# EAGLE design Lumiboard-SMD-DX-v003-stew (EAGLE 6.3)
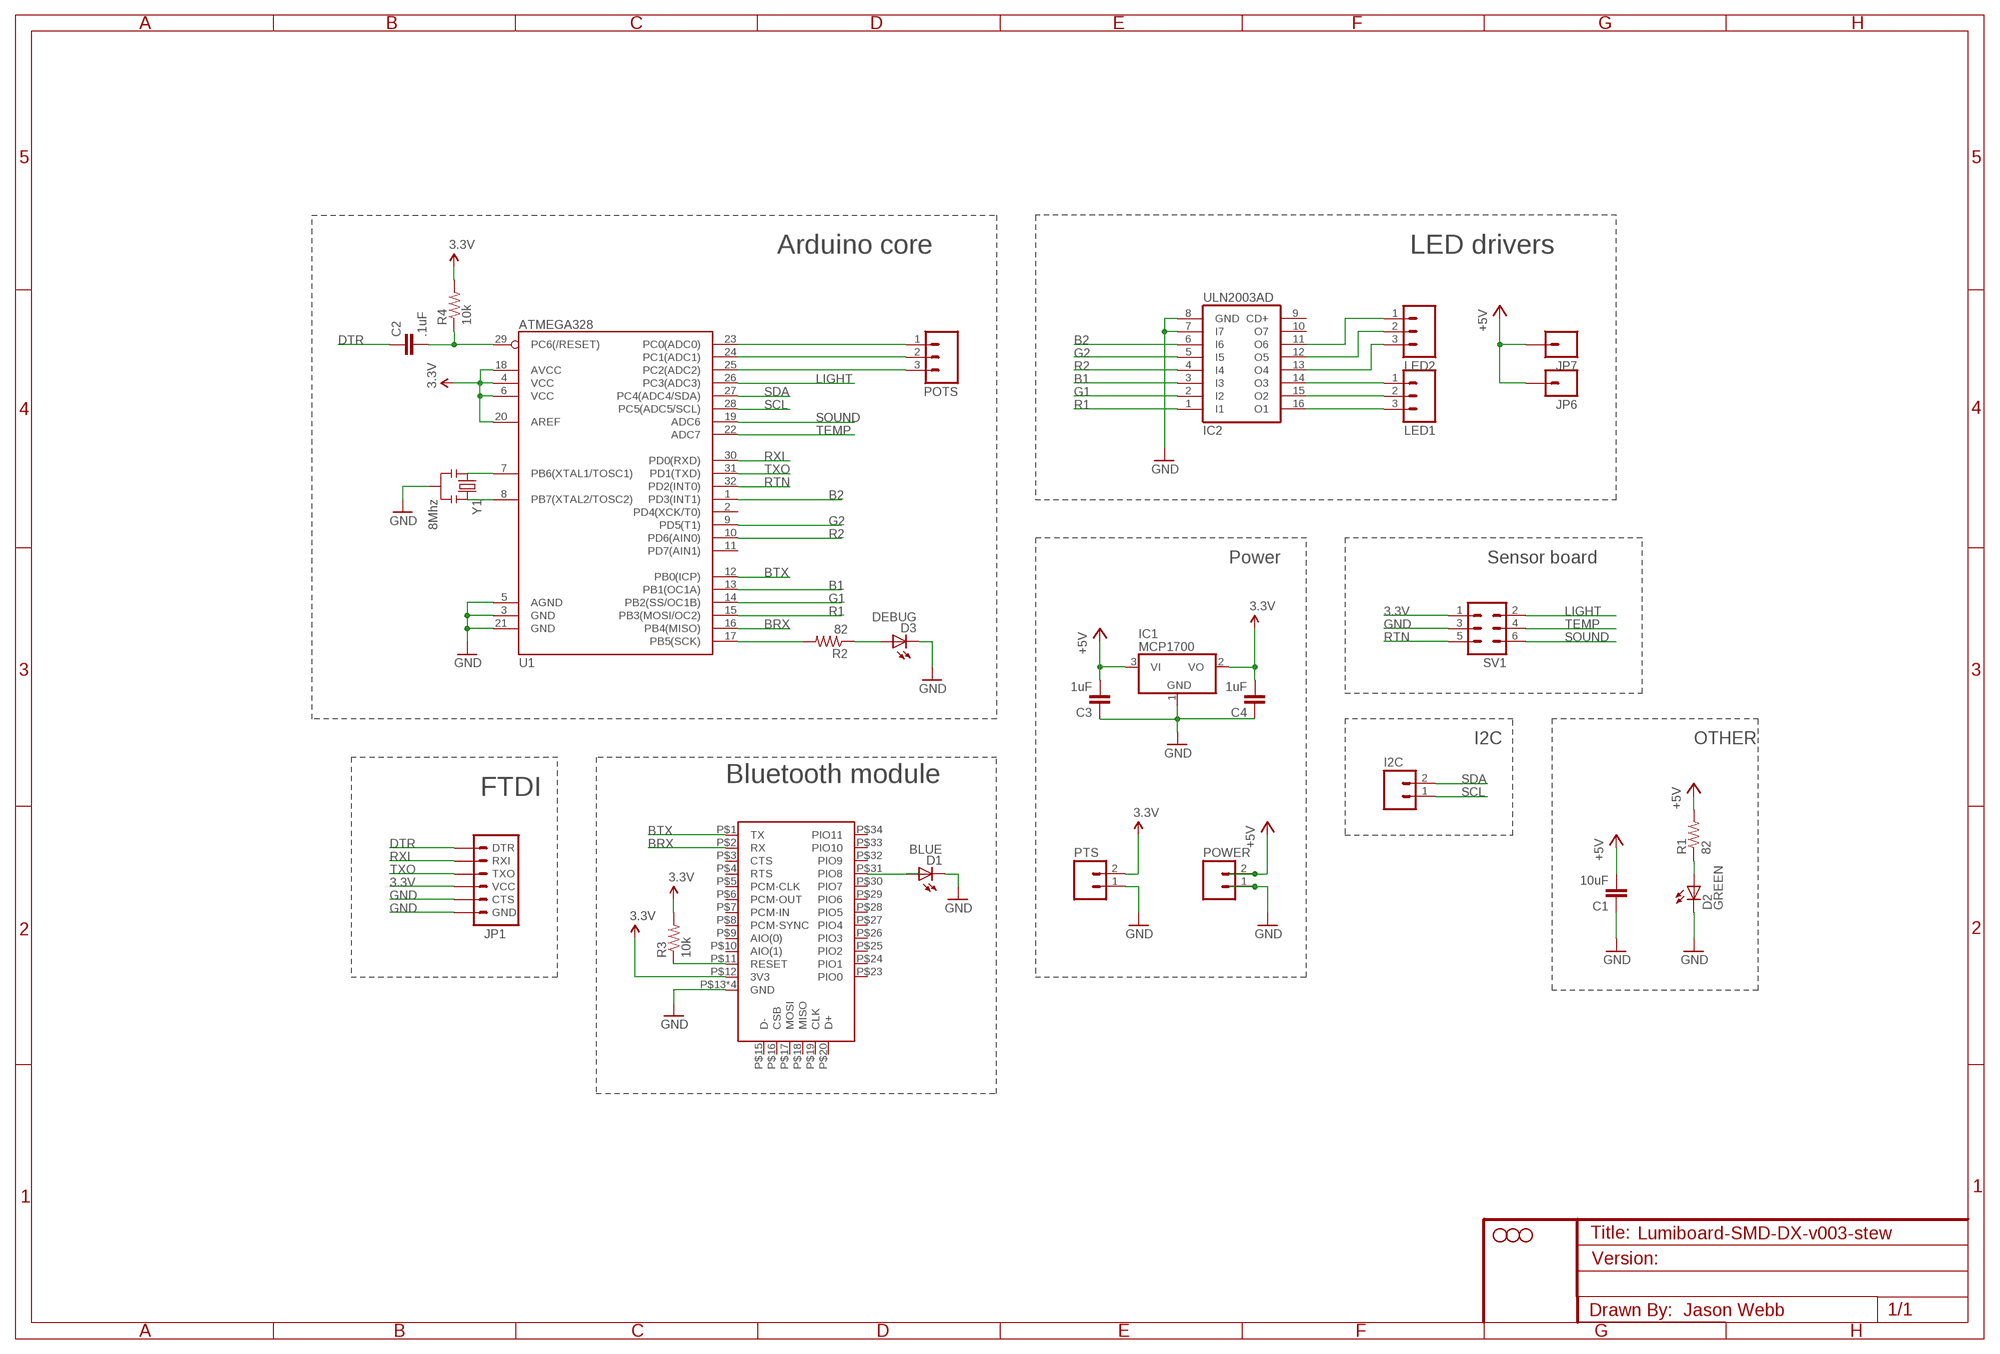
[diagram p0: schematic, sheet 1]

## Parts
C1  10uF  CAP0805  [0805]
C2  .1uF  CAP0805  [0805]
C3  1uF  CAP0805  [0805]
C4  1uF  CAP0805  [0805]
D1  BLUE  LEDCHIPLED_0805  [CHIPLED_0805]
D2  GREEN  LEDCHIPLED_0805  [CHIPLED_0805]
D3  DEBUG  LEDCHIPLED_0805  [CHIPLED_0805]
I2C  M02PTH  [1X02]
IC1  MCP1700  MCP1703CB  [SOT23]
IC2  ULN2003AD  [SO16]
JP1  ARDUINO_SERIAL_PROGRAMLOCK  [1X06_LOCK]
JP2  STAND-OFFTIGHT  [STAND-OFF-TIGHT]
JP4  STAND-OFFTIGHT  [STAND-OFF-TIGHT]
JP5  STAND-OFFTIGHT  [STAND-OFF-TIGHT]
JP6  M01PTH  [1X01]
JP7  M01PTH  [1X01]
LED1  M03PTH  [1X03]
LED2  M03PTH  [1X03]
POTS  M03PTH  [1X03]
POWER  M02PTH  [1X02]
PTS  M02PTH  [1X02]
R1  82  R-US_R0805  [R0805]
R2  82  R-US_R0805  [R0805]
R3  10k  R-US_R0805  [R0805]
R4  10k  R-US_R0805  [R0805]
SV1  ML6  [ML6]
U1  ATMEGA328  ATMEGA168  [TQFP32-08]
U2  DX_BT_MODULE  [DXBLUETOOTHMODULE]
Y1  8Mhz  RESONATORSMD  [RESONATOR-SMD]

## Nets
3.3V: C4.2 IC1.2(VO) JP1.4(VCC) PTS.2 R3.2 R4.2 SV1.1 U1.4(VCC) U1.6(VCC) U1.18(AVCC) U1.20(AREF) U2.P$12(3V3)
+5V: C1.2 C3.2 IC1.3(VI) JP6.1 JP7.1 POWER.2 R1.2
B1: IC2.3(I3) U1.13(PB1(OC1A))
B2: IC2.6(I6) U1.1(PD3(INT1))
BRX: U1.16(PB4(MISO)) U2.P$2(RX)
BTX: U1.12(PB0(ICP)) U2.P$1(TX)
DTR: C2.1 JP1.1(DTR)
G1: IC2.2(I2) U1.14(PB2(SS/OC1B))
G2: IC2.5(I5) U1.9(PD5(T1))
GND: C1.1 C3.1 C4.1 D1.C D2.C D3.C IC1.1(GND) IC2.7(I7) IC2.8(GND) JP1.5(CTS) JP1.6(GND) POWER.1 PTS.1 SV1.3 U1.3(GND) U1.5(AGND) U1.21(GND) U2.P$13(GND) U2.P$14(GND) U2.P$21(GND) U2.P$22(GND) Y1.2
LIGHT: SV1.2 U1.26(PC3(ADC3))
N$1: IC2.11(O6) LED2.1
N$2: D1.A U2.P$31(PIO8)
N$3: IC2.12(O5) LED2.2
N$4: R2.2 U1.17(PB5(SCK))
N$5: IC2.13(O4) LED2.3
N$7: U1.7(PB6(XTAL1/TOSC1)) Y1.1
N$8: U1.8(PB7(XTAL2/TOSC2)) Y1.3
N$9: D2.A R1.1
N$10: C2.2 R4.1 U1.29(PC6(/RESET))
N$11: R3.1 U2.P$11(RESET)
N$12: POTS.3 U1.25(PC2(ADC2))
N$13: D3.A R2.1
N$17: IC2.14(O3) LED1.1
N$18: IC2.15(O2) LED1.2
N$19: IC2.16(O1) LED1.3
N$20: POTS.2 U1.24(PC1(ADC1))
N$22: POTS.1 U1.23(PC0(ADC0))
R1: IC2.1(I1) U1.15(PB3(MOSI/OC2))
R2: IC2.4(I4) U1.10(PD6(AIN0))
RTN: SV1.5 U1.32(PD2(INT0))
RXI: JP1.2(RXI) U1.30(PD0(RXD))
SCL: I2C.1 U1.28(PC5(ADC5/SCL))
SDA: I2C.2 U1.27(PC4(ADC4/SDA))
SOUND: SV1.6 U1.19(ADC6)
TEMP: SV1.4 U1.22(ADC7)
TXO: JP1.3(TXO) U1.31(PD1(TXD))
Unconnected: IC2.9(CD+) IC2.10(O7) U1.2(PD4(XCK/T0)) U1.11(PD7(AIN1)) U2.P$3(CTS) U2.P$4(RTS) U2.P$5(PCM-CLK) U2.P$6(PCM-OUT) U2.P$7(PCM-IN) U2.P$8(PCM-SYNC) U2.P$9(AIO(0)) U2.P$10(AIO(1)) U2.P$15(D-) U2.P$16(CSB) U2.P$17(MOSI) U2.P$18(MISO) U2.P$19(CLK) U2.P$20(D+) U2.P$23(PIO0) U2.P$24(PIO1) U2.P$25(PIO2) U2.P$26(PIO3) U2.P$27(PIO4) U2.P$28(PIO5) U2.P$29(PIO6) U2.P$30(PIO7) U2.P$32(PIO9) U2.P$33(PIO10) U2.P$34(PIO11)

## Notes on the sheet
- Arduino core | LED drivers
- Power | Sensor board
- I2C | OTHER
- Bluetooth module
- FTDI
- Jason Webb

## Library data of the parts
C1-C4 = SparkFun:CAP: Capacitor Standard 0603 ceramic capacitor, and 0.1" leaded capacitor.
D1-D3 = led:LED: LED OSRAM: - CHIPLED LG R971, LG N971, LY N971, LG Q971, LY Q971, LO R971, LY R971 LH N974, LH R974 LS Q976, LO Q976, LY Q976 LO Q996 - Hyper CHIPLED LW Q18S LB Q993, LB Q99A, LB R99A - SideLED LS A670, LO A670, LY A670, LG A670, LP A670 LB A673, LV A673, LT A673, LW A673 LH A674 LY A675 LS A676, LA A676, LO A676, LY A676, LW A676 LS A679, LY A679, LG A679 - Hyper Micro SIDELED® LS Y876, LA Y876, LO Y876, LY Y876 LT Y87S - SmartLED LW L88C, LW L88S LB L89C, LB L89S, LG L890 LS L89K, LO L89K, LY L89K LS L896, LA L896, LO L896, LY L896 - TOPLED LS T670, LO T670, LY T670, LG T670, LP T670 LSG T670, LSP T670, LSY T670, LOP T670, LYG T670 LG T671, LOG T671, LSG T671 LB T673, LV T673, LT T673, LW T673 LH T674 LS T676, LA T676, LO T676, LY T676, LB T676, LH T676, LSB T676, LW T676 LB T67C, LV T67C, LT T67C, LS T67K, LO T67K, LY T67K, LW E67C LS E67B, LA E67B, LO E67B, LY E67B, LB E67C, LV E67C, LT E67C LW T67C LS T679, LY T679, LG T679 LS T770, LO T770, LY T770, LG T770, LP T770 LB T773, LV T773, LT T773, LW T773 LH T774 LS E675, LA E675, LY E675, LS T675 LS T776, LA T776, LO T776, LY T776, LB T776 LHGB T686 LT T68C, LB T68C - Hyper Mini TOPLED® LB M676 - Mini TOPLED Santana® LG M470 LS M47K, LO M47K, LY M47K Source: http://www.osram.convergy.de LUXEON: - LUMILED® LXK2-PW12-R00, LXK2-PW12-S00, LXK2-PW14-U00, LXK2-PW14-V00 LXK2-PM12-R00, LXK2-PM12-S00, LXK2-PM14-U00 LXK2-PE12-Q00, LXK2-PE12-R00, LXK2-PE12-S00, LXK2-PE14-T00, LXK2-PE14-U00 LXK2-PB12-K00, LXK2-PB12-L00, LXK2-PB12-M00, LXK2-PB14-N00, LXK2-PB14-P00, LXK2-PB14-Q00 LXK2-PR12-L00, LXK2-PR12-M00, LXK2-PR14-Q00, LXK2-PR14-R00 LXK2-PD12-Q00, LXK2-PD12-R00, LXK2-PD12-S00 LXK2-PH12-R00, LXK2-PH12-S00 LXK2-PL12-P00, LXK2-PL12-Q00, LXK2-PL12-R00 Source: www.luxeon.com KINGBRIGHT: KA-3528ASYC Source: www.kingbright.com
I2C POWER PTS = SparkFun:M02: Header 2 Standard 2-pin 0.1" header. Use with straight break away headers (SKU : PRT-00116), right angle break away headers (PRT-00553), swiss pins (PRT-00743), machine pins (PRT-00117), and female headers (PRT-00115). Molex polarized connector foot print use with SKU : PRT-08233 with associated crimp pins and housings.
IC1 = linear:MCP1703: 250 mA, 16V, Low Quiescent Current LDO Regulator Source: http://ww1.microchip.com/downloads/en/DeviceDoc/22049b.pdf
IC2 = uln-udn:ULN2003A: DRIVER ARRAY
JP1 = SparkFun:ARDUINO_SERIAL_PROGRAM
JP2 JP4 JP5 = SparkFun:STAND-OFF: Stand Off This is the mechanical footprint for a #4 phillips button head screw. Use the keepout ring to avoid running the screw head into surrounding components. SKU : PRT-00447
JP6 JP7 = SparkFun:M01: Header 1 Standard 1-pin 0.1" header. Use with straight break away headers (SKU : PRT-00116), right angle break away headers (PRT-00553), swiss pins (PRT-00743), machine pins (PRT-00117), and female headers (PRT-00115).
LED1 LED2 POTS = SparkFun:M03: Header 3 Standard 3-pin 0.1" header. Use with straight break away headers (SKU : PRT-00116), right angle break away headers (PRT-00553), swiss pins (PRT-00743), machine pins (PRT-00117), and female headers (PRT-00115). Molex polarized connector foot print use with SKU : PRT-08232 with associated crimp pins and housings.
R1-R4 = resistor:R-US_: RESISTOR, American symbol
SV1 = con-harting-ml:ML6: HARTING; OC_FARNELL: unknown; OC_NEWARK: unknown
U1 = SparkFun:ATMEGA168
U2 = Richardson:DX_BT_MODULE: http://www.dealextreme.com/p/wireless-bluetooth-rs232-ttl-transceiver-module-80711
Y1 = SparkFun:RESONATOR: Resonator Small SMD resonator. This is the itty bitty 10/20MHz resonators with built in caps. CSTCE10M0G55 and CSTCE20M0V53. Footprint has been reviewed closely but hasn't been tested yet.

## Net classes
0 Power: width 0.254 mm, drill 0.305 mm, clearance 0.203 mm

## Board
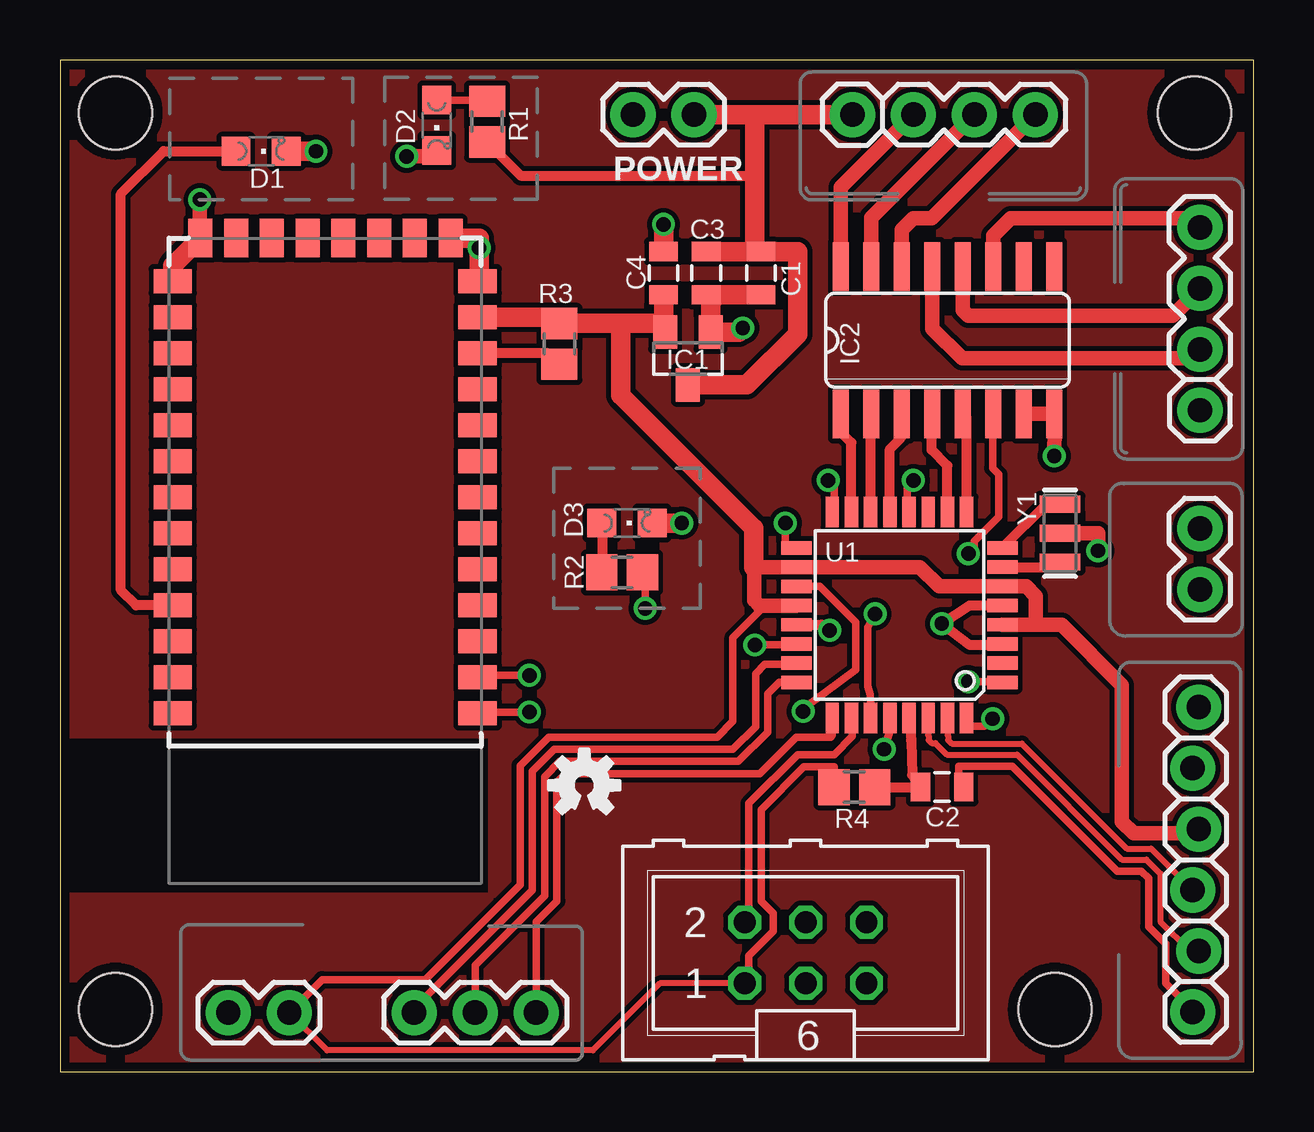
[diagram p1: board, top side]
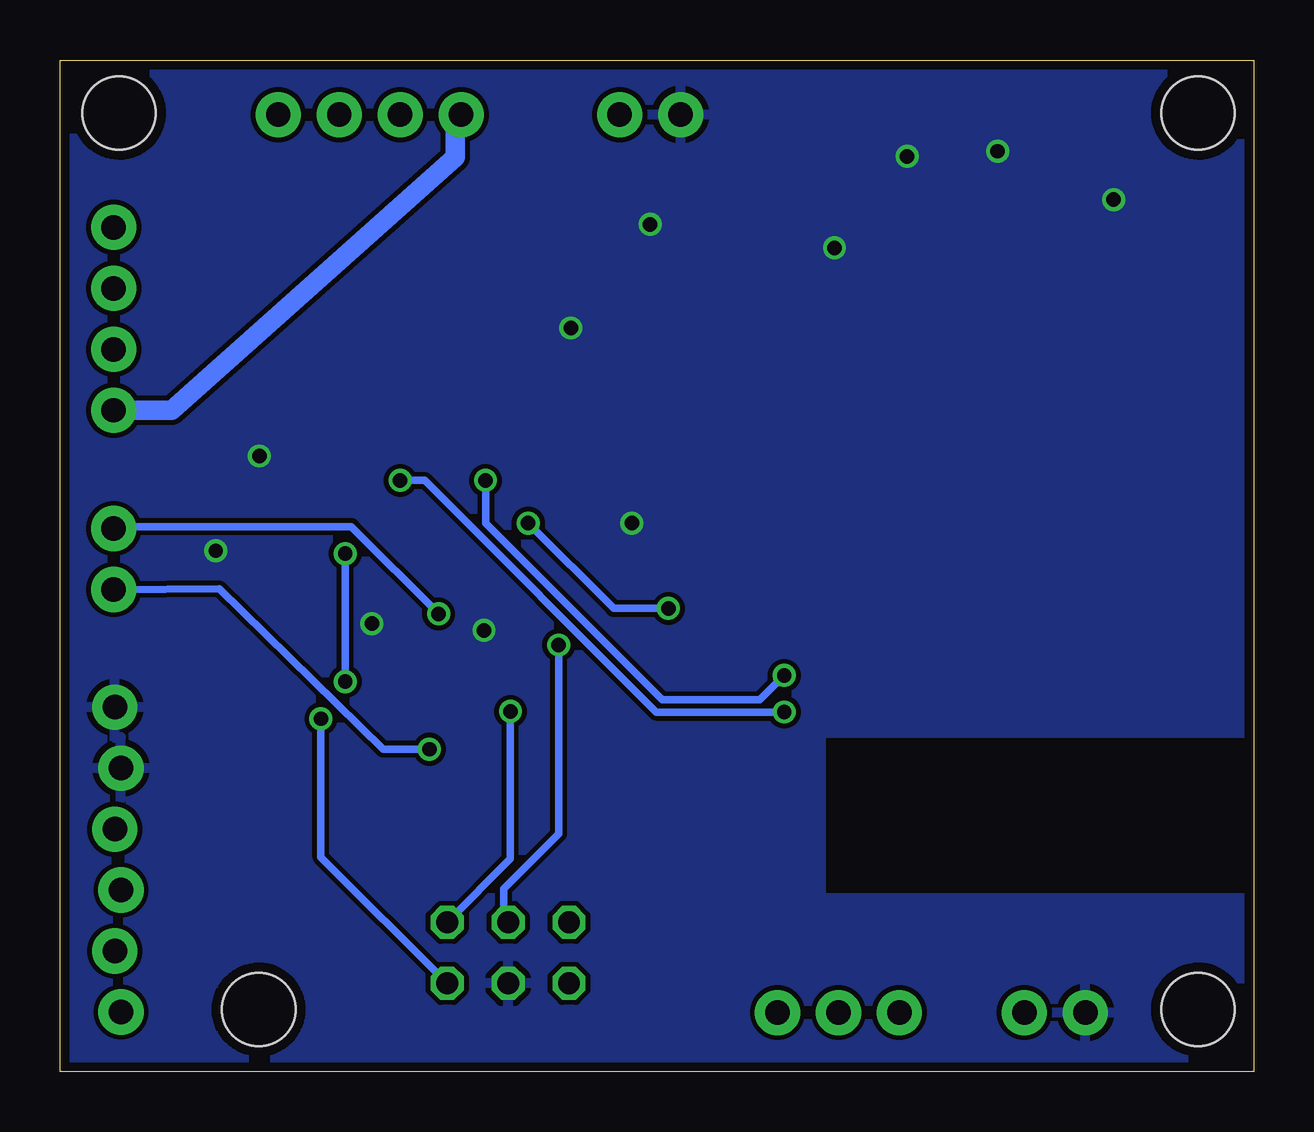
[diagram p2: board, bottom side, seen from below]

Size 49.73 x 42.15 mm. Coordinates in mm from the lower left corner, seen from the top.
Outline: 0,0 49.73,0 49.73,42.15 0,42.15 0,0
Copper layers (1*16): Top 0.0356mm / dielectric 1.5011mm / Bottom 0.0356mm
Design rules "LaenPCBOrder": minimum track width 6mil, minimum drill 13mil, track to track 6mil, track to pad 6mil, pad to pad 6mil, via to via 6mil, smd to smd 6mil, copper to edge 15mil, drill to drill 6mil, minimum pad ring 7mil, minimum via ring 7mil, stop-mask expansion 4mil, vias tented up to drill 0mil, thermal gap 10mil

### Footprints (pad centres in the part's own frame; a part is rotated, then mirrored left to right if it is on the bottom)
0805 = smd 0.8 x 1.2: 1 -0.9,0; 2 0.9,0
CHIPLED_0805 = smd 1.2 x 1.2: A 0,-1.05; C 0,1.05
1X02 = drill 1.016 pad 1.88: 1 0,0; 2 2.54,0
SOT23 = smd 1 x 1.4: 1 -0.95,-1.1; 2 0.95,-1.1; 3 0,1.1
SO16 = smd 0.66 x 2.032: 1 -4.445,-3.073; 2 -3.175,-3.073; 3 -1.905,-3.073; 4 -0.635,-3.073; 5 0.635,-3.073; 6 1.905,-3.073; 7 3.175,-3.073; 8 4.445,-3.073; 9 4.445,3.073; 10 3.175,3.073; 11 1.905,3.073; 12 0.635,3.073; 13 -0.635,3.073; 14 -1.905,3.073; 15 -3.175,3.073; 16 -4.445,3.073
1X06_LOCK = drill 1.016 pad 1.88: 1 0,0; 2 2.54,-0.254; 3 5.08,0; 4 7.62,-0.254; 5 10.16,0; 6 12.7,-0.254
STAND-OFF-TIGHT = hole 3.048: 0,0
1X01 = drill 1.016 pad 1.88: 1 0,0
1X03 = drill 1.016 pad 1.88: 1 0,0; 2 2.54,0; 3 5.08,0
R0805 = smd 1.3 x 1.5: 1 -0.85,0; 2 0.85,0
ML6 = drill 0.914 octagon: 1 -2.54,-1.27; 2 -2.54,1.27; 3 0,-1.27; 4 0,1.27; 5 2.54,-1.27; 6 2.54,1.27
TQFP32-08 = smd 1.27 x 0.559: 1 -4.293,2.8; 2 -4.293,2; 3 -4.293,1.2; 4 -4.293,0.4; 5 -4.293,-0.4; 6 -4.293,-1.2; 7 -4.293,-2; 8 -4.293,-2.8; 17 4.293,-2.8; 18 4.293,-2; 19 4.293,-1.2; 20 4.293,-0.4; 21 4.293,0.4; 22 4.293,1.2; 23 4.293,2; 24 4.293,2.8 | smd 0.559 x 1.27: 9 -2.8,-4.293; 10 -2,-4.293; 11 -1.2,-4.293; 12 -0.4,-4.293; 13 0.4,-4.293; 14 1.2,-4.293; 15 2,-4.293; 16 2.8,-4.293; 25 2.8,4.293; 26 2,4.293; 27 1.2,4.293; 28 0.4,4.293; 29 -0.4,4.293; 30 -1.2,4.293; 31 -2,4.293; 32 -2.8,4.293
DXBLUETOOTHMODULE = smd 1.6 x 1: P$1 -6.35,6.35; P$2 -6.35,4.85; P$3 -6.35,3.35; P$4 -6.35,1.85; P$5 -6.35,0.35; P$6 -6.35,-1.15; P$7 -6.35,-2.65; P$8 -6.35,-4.15; P$9 -6.35,-5.65; P$10 -6.35,-7.15; P$11 -6.35,-8.65; P$12 -6.35,-10.15; P$13 -6.35,-11.66; P$22 6.35,-11.66; P$23 6.35,-10.15; P$24 6.35,-8.65; P$25 6.35,-7.15; P$26 6.35,-5.65; P$27 6.35,-4.15; P$28 6.35,-2.65; P$29 6.35,-1.15; P$30 6.35,0.35; P$31 6.35,1.85; P$32 6.35,3.35; P$33 6.35,4.85; P$34 6.35,6.35 | smd 1 x 1.6: P$14 -5.23,-13.45; P$15 -3.74,-13.45; P$16 -2.25,-13.45; P$17 -0.76,-13.45; P$18 0.73,-13.45; P$19 2.22,-13.45; P$20 3.71,-13.45; P$21 5.2,-13.45
RESONATOR-SMD = smd 0.7 x 1.7: 1 -1.2,0; 2 0,0; 3 1.2,0

### Placement (x,y rotation side)
C1  29.21,33.27 90 top
C2  36.75,11.86 180 top
C3  26.92,33.27 90 top
C4  25.15,33.27 270 top
D1  8.38,38.35 270 top
D2  15.7,39.43 180 top
D3  23.62,22.86 270 top
I2C  47.5,20.09 90 top
IC1  26.16,29.72 180 top
IC2  36.98,30.48 0 top
JP1  47.19,2.49 90 top
JP2  2.31,39.95 0 top
JP3  STAND-OFFTIGHT  [STAND-OFF-TIGHT]  47.27,39.95 0 top
JP4  41.45,2.59 0 top
JP5  2.31,2.59 0 top
JP6  47.5,27.56 0 top
JP7  33.02,39.88 270 top
LED1  40.64,39.88 180 top
LED2  47.5,35.18 270 top
POTS  14.76,2.46 0 top
POWER  23.88,39.88 0 top
PTS  7.01,2.46 0 top
R1  17.79,39.59 270 top
R2  23.42,20.8 0 top
R3  20.8,30.33 90 top
R4  33.1,11.86 180 top
SV1  31.06,4.95 0 top
U1  34.98,19.02 180 top
U2  11.05,21.29 180 top
U$1  [OSHW-LOGO-S]  21.84,11.94 0 top
Y1  41.67,22.44 90 top

### Tracks (layer width: path | path; a pad name or v marks a point on that pad's centre or on a via)
3.3V
  Top 0.254: SV1.1 24.99,3.68 22.2,0.89 11.12,0.89 PTS.2
  Top 0.305: PTS.2 10.92,3.83 15.21,3.83 19.18,7.8 19.18,12.75 20.37,13.95 27.38,13.95 28.04,14.61 28.04,18.09 29.14,19.18 29.14,19.43 | R4.2 32.26,11.94 32.26,12.7 30.99,12.7 29.21,10.92 29.21,7.11 29.72,6.6 29.72,5.84 28.7,4.83 28.7,3.81 SV1.1
  Top 0.61: 40.66,18.62 41.73,18.62 44.25,16.1 44.25,10.41 44.73,9.93 47.27,9.93 JP1.4 | 40.66,18.62 U1.4 | 40.66,18.62 40.66,19.81 40.25,20.23 U1.6 36.63,20.22 35.82,21.02 U1.18 28.93,21.02 28.93,21.01 | 28.93,21.01 28.93,19.63 29.14,19.43 U1.20 | 28.93,21.01 28.91,21.02
  Top 0.813: 28.91,21.02 28.91,22.65 23.37,28.19 23.37,31.18 | C4.2 25.15,31.18 | 23.37,31.18 R3.2 20.55,31.43 U2.P$12 | 23.37,31.18 25.15,31.18 | 25.15,31.18 25.21,31.11 IC1.2
+5V
  Top 0.406: R1.2 19.19,37.34 28.7,37.34 arc-90 28.96,37.08
  Top 0.813: IC1.3 28.62,28.62 30.73,30.73 30.73,34.17 C1.2 | C3.2 C1.2 | JP7.1 28.96,39.88 | 28.96,39.88 POWER.2 | C1.2 28.96,34.43 28.96,37.08 28.96,39.88
  Bottom 0.813: JP6.1 45.09,27.56 33.27,38.1 33.27,39.62 JP7.1
B1
  Top 0.406: U1.13 34.58,25.94 35.05,26.42 35.05,27.38 IC2.3
B2  (via drill 0.6)
  Top 0.305: 38.91,26.67 38.89,26.7 IC2.6 38.86,26.67 38.86,25.15 39.12,24.89 39.12,23.11 38.1,22.1 38.1,21.84 v37.85,21.59 | v37.85,16.26 39.12,16.26 U1.1
  Bottom 0.305: v37.85,16.26 v37.85,21.59
BRX  (via drill 0.6)
  Top 0.305: v19.56,16.51 17.53,16.51 U2.P$2 | v32,24.64 32.26,24.38 32.26,23.37 U1.16
  Bottom 0.305: v19.56,16.51 20.57,15.49 24.64,15.49 32,22.86 v32,24.64
BTX  (via drill 0.6)
  Top 0.305: v19.56,14.99 17.53,14.99 U2.P$1 | v35.56,24.64 35.31,24.38 35.31,23.37 U1.12
  Bottom 0.305: v19.56,14.99 24.89,14.99 34.54,24.64 v35.56,24.64
DTR
  Top 0.305: JP1.1 47.19,2.56 46.08,3.68 46.08,5.33 45.36,6.04 45.36,8.05 45.06,8.36 44.04,8.36 39.67,12.72 37.44,12.72 37.44,12.09 C2.1
G1
  Top 0.406: U1.14 33.78,27.38 IC2.2
G2
  Top 0.406: U1.9 37.78,27.25 IC2.5
GND  (via drill 0.6, 0.6 pad 0)
  Top 0.406: U1.5 37.89,19.43 v36.74,18.67 37.88,17.79 38.1,17.78 39.31,17.78 U1.3 | U1.21 31.73,18.62 v32.07,18.39 | U2.P$14 16.19,34.73
  Top 0.61: D2.C 15.84,38.15 v14.44,38.14 | v41.43,25.65 41.44,26.9 IC2.8 IC2.7 | Y1.2 43.26,22.44 43.26,22.28 v43.24,21.7 | U2.P$21 5.83,34.73 v5.83,36.34
  Top 0.813: U2.P$22 4.7,33.59 U2.P$21 | U2.P$13 17.46,32.95 v17.46,34.33 17.46,34.73 U2.P$14 | D1.C v10.67,38.35 | C4.1 v25.15,35.31 | C1.1 27.43,32.37 | 27.43,32.37 C3.1 | 27.43,32.37 27.11,32.05 IC1.1 28.28,30.82 v28.45,30.99 | D3.C v25.91,22.86
  pour Bottom: -0.25,-0.25 50.04,-0.25 50.04,42.48 -0.25,42.48 -0.25,14.1 18.03,14.1 18.03,7.24 -0.25,7.24
LIGHT
  Top 0.305: SV1.2 28.7,6.35 28.7,11.18 30.73,13.21 32.26,13.21 33.02,13.97 33.02,14.73 U1.26
N$1
  Top 0.61: IC2.11 38.89,34.82 39.62,35.56 47.12,35.56 LED2.1
N$2
  Top 0.406: U2.P$31 3.17,19.43 2.54,20.07 2.54,36.58 4.32,38.35 D1.A
N$3
  Top 0.61: IC2.12 37.62,31.73 37.85,31.5 46.35,31.5 LED2.2
N$4  (via drill 0.6)
  Top 0.305: v24.38,19.3 24.38,20.57 R2.2 | v30.23,22.86 30.23,21.84 30.48,21.84 U1.17
  Bottom 0.305: v24.38,19.3 26.67,19.3 v30.23,22.86
N$5
  Top 0.61: IC2.13 36.35,30.96 37.59,29.72 47.12,29.72 LED2.3
N$6
  pour Top: -0.25,-0.25 50.04,-0.25 50.06,42.47 -0.25,42.47 -0.25,14.1 18.03,14.1 18.03,7.24 -0.25,7.24
N$7
  Top 0.406: U1.7 41.45,21.02 Y1.1
N$8
  Top 0.406: Y1.3 41.09,23.64 U1.8
N$9
  Top 0.254: R1.1 17.79,40.54
  Top 0.305: D2.A 17.75,40.48 R1.1
N$10
  Top 0.406: R4.1 C2.2 35.5,12.37 35.46,13.79 U1.29
N$11
  Top 0.406: R3.1 20.34,29.93 U2.P$11
N$12
  Top 0.305: POTS.3 19.84,6.25 20.7,7.11 20.7,12.06 21.06,12.42 29.16,12.42 30.68,13.95 32.11,13.95 32.18,14.02 U1.25
N$13
  Top 0.406: D3.A 22.61,22.86 22.61,20.83 R2.1
N$17
  Top 0.61: IC2.14 35.08,35.08 35.56,35.56 36.32,35.56 LED1.1
N$18
  Top 0.61: IC2.15 33.81,35.59 LED1.2
N$19
  Top 0.61: IC2.16 32.54,36.85 LED1.3
N$20
  Top 0.305: POTS.2 17.3,4.45 20.19,7.34 20.19,12.29 20.83,12.93 28.27,12.93 29.49,14.15 29.49,15.75 29.97,16.23 30.68,16.23 U1.24
N$22
  Top 0.305: POTS.1 14.76,2.64 19.68,7.57 19.68,12.52 20.6,13.44 28.04,13.44 28.98,14.38 28.98,16.59 29.36,16.97 30.63,16.97 U1.23
R1
  Top 0.406: U1.15 32.98,26.21 32.51,26.67 32.51,27.38 IC2.1
R2
  Top 0.406: U1.10 36.98,25.25 36.32,25.91 36.32,27.38 IC2.4
RTN  (via drill 0.6)
  Top 0.305: U1.32 37.77,14.4 38.48,14.4 38.86,14.53 v38.86,14.71
  Bottom 0.305: v38.86,14.71 38.86,8.94 SV1.5
RXI
  Top 0.254: JP1.2 47.07,5.03 45.85,6.25 45.85,8.26 45.26,8.84 44.25,8.84 39.88,13.21 36.96,13.21 36.47,13.69 36.32,13.69 36.2,13.82 36.2,13.99 36.17,14.02 36.17,14.63 U1.30
SCL  (via drill 0.6)
  Top 0.305: v34.34,13.44 34.59,14.25 34.57,14.53 U1.28
  Bottom 0.305: I2C.1 43.1,20.12 36.27,13.44 v34.34,13.44
SDA  (via drill 0.6)
  Top 0.305: v33.96,19.07 33.66,18.52 33.66,16.05 33.76,15.7 33.76,15.47 33.78,15.44 U1.27
  Bottom 0.305: I2C.2 47.32,22.71 37.59,22.71 v33.96,19.07
SOUND  (via drill 0.6)
  Top 0.305: v30.96,15.01 31.22,15.32 33.15,16.74 33.15,18.72 31.65,20.22 U1.19
  Bottom 0.305: v30.96,15.01 30.96,8.87 SV1.6
TEMP  (via drill 0.6)
  Top 0.305: v28.96,17.78 30.48,17.78 U1.22
  Bottom 0.305: v28.96,17.78 28.96,9.91 31.24,7.62 31.24,6.35 SV1.4
TXO
  Top 0.254: JP1.3 45.47,9.3 44.45,9.3 40.08,13.66 37.16,13.66 37.01,13.82 37.01,13.99 36.98,14.02 36.98,14.61 U1.31

### Text on the board
tDocu: BLUETOOTH | + | +5V | R | G | B | LUMIBOARD | POWER | LED1 | B | G | ULN2003 | LED2 | R | BLUETOOTH | TRANSCEIVER | +5V | A4 | SDA | MAIN BOARD | SCL | ATMEGA328 | A5 | B | REV A | FTDI (3.3V) | OSHW | POTS/INPUT | GND | 3.3V | A0 | A1 | A2 | G
bDocu: PCB design help from Stew Koch | Lead engineer + designe | Jason Webb